# Altium schematic sheet Motor_Driver.SchDoc
size A4; SheetNumber: 3; SheetTotal: 6
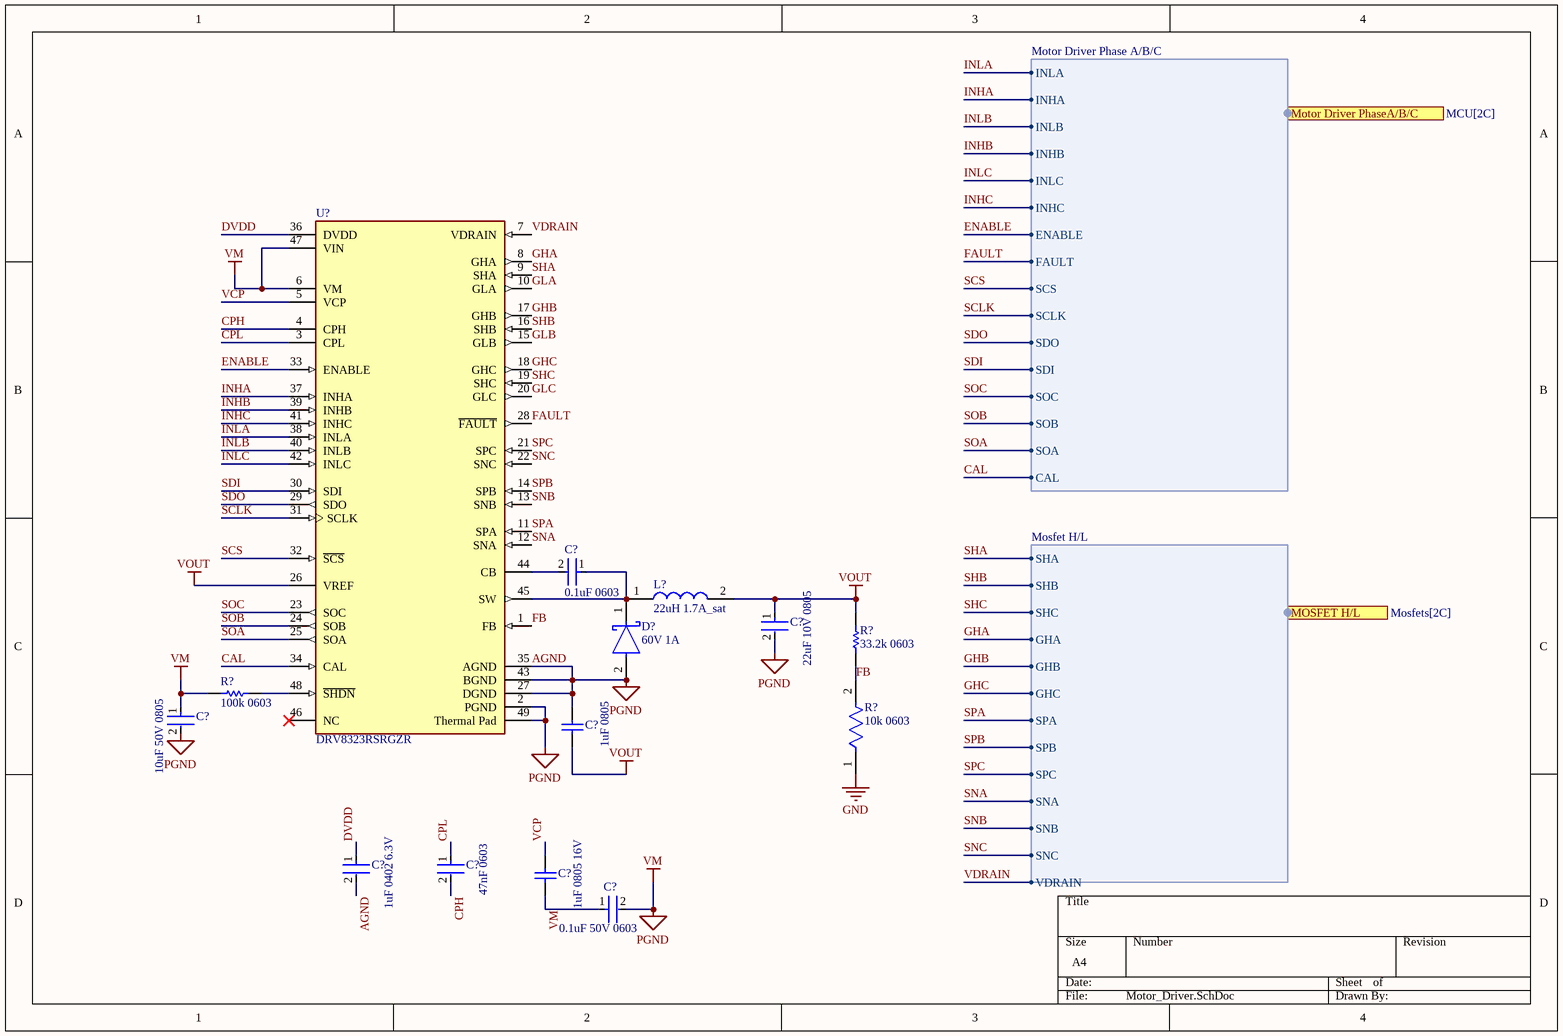
[diagram p0: Motor_Driver.SchDoc]

## Parts
(Parts that share a designator on the sheet are numbered #1, #2 ... from top to bottom, then left to right.)
C?#1  0.1uF 0603  [FP-0603B104K500CT-IPC_C]
C?#2  22uF 10V 0805  [FP-GRM21B-0_2-e0_2_0_7-MFG]
C?#3  10uF 50V 0805  [FP-GRM21B-0_2-e0_2_0_7-IPC_A]
C?#4  1uF 0805  [CAPC2013X140X50NL20T25]
C?#5  1uF 0402 6.3V  [FP-GRT155-0_05-IPC_C]
C?#6  47nF 0603  [FP-C0603C-CF-MFG]
C?#7  1uF 0805 16V  [CAPC2013X140X50NL20T25]
C?#8  0.1uF 50V 0603  [FP-0603B104K500CT-IPC_C]
D?  60V 1A  [FP-SMA-MFG]
L?  22uH 1.7A_sat  [INDPM6054X300N]
R?#1  33.2k 0603  [RESC1608X55X25NL10T15]
R?#2  100k 0603  [RESC1608X55X25ML10T15]
R?#3  10k 0603  [FP-RT0603-MFG]
U?  DRV8323RSRGZR  [FP-RGZ0048A-MFG]

## Ports
MOSFET H/L (harness Mosfet H/L, see Mosfets[2C]), Motor Driver PhaseA/B/C (harness Motor Driver Phase A/B/C, see MCU[2C])

## Harnesses
Motor Driver Phase A/B/C: INLA, INLC, INHB, INLB, INHA, INHC, ENABLE, FAULT, SCLK, SDO, SDI, SCS, SOC, SOB, SOA, CAL
Mosfet H/L: SHA, SHB, SHC, GHA, GHB, GHC, SPB, SPA, SPC, SNA, SNB, SNC, VDRAIN

## Nets
AGND: C?#2.2 C?#3.1 C?#3.2 C?#4.2 C?#5.2 C?#7.1 C?#8.1 C?#8.2 D?.2(A) R?#2.2 U?.2(PGND) U?.6(VM) U?.27(DGND) U?.35(AGND) U?.43(BGND) U?.47(VIN) U?.49(Thermal_Pad)  [also labelled PGND, VM]
GND: R?#3.1
VOUT: C?#2.1 C?#4.1 L?.2 R?#1.2 U?.26(VREF)
CAL: U?.34(CAL) ; port Motor Driver PhaseA/B/C.CAL
CPH: C?#6.2 U?.4(CPH)
CPL: C?#6.1 U?.3(CPL)
DVDD: C?#5.1 U?.36(DVDD)
ENABLE: U?.33(ENABLE) ; port Motor Driver PhaseA/B/C.ENABLE
FAULT: U?.28(~{FAULT}) ; port Motor Driver PhaseA/B/C.FAULT
FB: R?#1.1 R?#3.2 U?.1(FB)
GHA: U?.8(GHA) ; port MOSFET H/L.GHA
GHB: U?.17(GHB) ; port MOSFET H/L.GHB
GHC: U?.18(GHC) ; port MOSFET H/L.GHC
GLA: U?.10(GLA)
GLB: U?.15(GLB)
GLC: U?.20(GLC)
INHA: U?.37(INHA) ; port Motor Driver PhaseA/B/C.INHA
INHB: U?.39(INHB) ; port Motor Driver PhaseA/B/C.INHB
INHC: U?.41(INHC) ; port Motor Driver PhaseA/B/C.INHC
INLA: U?.38(INLA) ; port Motor Driver PhaseA/B/C.INLA
INLB: U?.40(INLB) ; port Motor Driver PhaseA/B/C.INLB
INLC: U?.42(INLC) ; port Motor Driver PhaseA/B/C.INLC
SCLK: U?.31(SCLK) ; port Motor Driver PhaseA/B/C.SCLK
SCS: U?.32(~{SCS}) ; port Motor Driver PhaseA/B/C.SCS
SDI: U?.30(SDI) ; port Motor Driver PhaseA/B/C.SDI
SDO: U?.29(SDO) ; port Motor Driver PhaseA/B/C.SDO
SHA: U?.9(SHA) ; port MOSFET H/L.SHA
SHB: U?.16(SHB) ; port MOSFET H/L.SHB
SHC: U?.19(SHC) ; port MOSFET H/L.SHC
SNA: U?.12(SNA) ; port MOSFET H/L.SNA
SNB: U?.13(SNB) ; port MOSFET H/L.SNB
SNC: U?.22(SNC) ; port MOSFET H/L.SNC
SOA: U?.25(SOA) ; port Motor Driver PhaseA/B/C.SOA
SOB: U?.24(SOB) ; port Motor Driver PhaseA/B/C.SOB
SOC: U?.23(SOC) ; port Motor Driver PhaseA/B/C.SOC
SPA: U?.11(SPA) ; port MOSFET H/L.SPA
SPB: U?.14(SPB) ; port MOSFET H/L.SPB
SPC: U?.21(SPC) ; port MOSFET H/L.SPC
VCP: C?#7.2 U?.5(VCP)
VDRAIN: U?.7(VDRAIN) ; port MOSFET H/L.VDRAIN
NetC?#1_1: C?#1.1 D?.1(C) L?.1 U?.45(SW)
NetC?#1_2: C?#1.2 U?.44(CB)
NetR?#2_1: R?#2.1 U?.48(~{SHDN})

Not connected (* = marked no-connect by the designer): U? 46(NC)*

## Library data of the parts
C?#1 C?#8 = CMP-45632-000007-1: CAP CER 0.1UF 50V X7R 0603; Tolerance: 10%; Capacitance: 100nF; Radiation Hardening: No; Depth: 0.8mm; Length: 1.6mm; Voltage Rating: 50V; Dielectric: X7R; Case/Package: 0603; RoHS Compliant: Yes; Case Code (Metric): 1608; Voltage Rating (DC): 50V; Min Operating Temperature: -55°C; Series: -; Max Operating Temperature: 125°C; Lead Free: Lead Free; Case Code (Imperial): 0603; Packaging: Tape and Reel
C?#2 = CMP-06035-051066-1: Chip Multilayer Ceramic Capacitors for General Purpose, 0805, 22uF, X7R, 15%, 20%, 10V
C?#3 = CMP-06035-004402-1: Chip Multilayer Ceramic Capacitors for General Purpose, 0805, 10uF, X5R, 15%, 10%, 50V; Voltage Rating (DC): 50V; Dielectric: X5R; Tolerance: 10%; Capacitance: 10uF; Thickness: 1.25mm; Length: 2mm; Width: 1.25mm
C?#4 C?#7 = CMP-2007-03229-1: Part Number: C0805C105J4RACTU; Manufacturer: Kemet
C?#5 = CMP-06035-034802-1: Multi-Layer Ceramic Capacitor 1uF 6.3V X7R ±10% 0402 Paper T/R
C?#6 = CMP-2006-03882-2: CAP CER 0.047UF 25V 10% X7R 0603; Manufacturer: KEMET; Manufacturer Part Number: C0603C473K3RACTU; Capacitance: 47,000 pF; Temperature Coefficient: 30ppm/°C; Material: Ceramic; Tolerance: 0.1; Value: 47,000 pF; Automotive Grade: Grade 1; Height: 0.87mm; Voltage Rating: 25 V; Automotive: Yes; Device Class L3: Ceramic Capacitors; Device Class L2: Capacitors; Mouser Description: Multilayer Ceramic Capacitor, C Series, 0.047 - F, - 10%, X7R, 25 V, 0603 [1608 Metric] Rohs Compliant: Yes; Digikey Description: CAP CER 0.047UF 25V 10% X7R 0603; Temperature Characteristic: X7R; Package: C0603C-CF; Device Class L1: Passive Components; Temperature: -55°C to +125°C; Octopart: https://octopart.com/c0603c473k3ractu-kemet-3834514; RoHS: TRUE; ComponentLink2Description: Datasheet; Temperature Range Low: -55°C; Temperature Range High: +125°C; Category: Cap; ComponentLink2URL: https://api.kemet.com/component-edge/download/datasheet/C0603C100J5GACAUTO.pdf; Lead Free: Yes
D? = CMP-2000-05885-2: DIODE SCHOTTKY 60V 1A SMA; Polarity: Standard; Element Configuration: Single; Peak Reverse Current: 500uA; Capacitance: 110pF; Peak Non-Repetitive Surge Current: 30A; Forward Voltage: 700mV; Termination: SMD/SMT; Radiation Hardening: No; Number of Pins: 2; Packaging: Tape and Reel; Length: 4.6mm; Current Rating: 1A; Lead Free: Lead Free; Output Current: 1A; Max Operating Temperature: 150°C; Min Operating Temperature: -65°C; Forward Current: 1A; Mount: Surface Mount; Width: 2.92mm; Average Rectified Current: 1A; Max Forward Surge Current (Ifsm): 30A; Voltage Rating (DC): 60V; Height: 2.1mm; REACH SVHC: No SVHC; Max Reverse Voltage (DC): 60V; Max Repetitive Reverse Voltage (Vrrm): 60V; Weight: 0.002258oz; Contact Plating: Tin; Case/Package: SMA; Package Quantity: 5000
L? = PA4340.223NLT: Inductor; Manufacturer_Name: Yageo Group; Datasheet Link: https://www.arrow.com/en/products/pa4340.223nlt/pulse-electronics-corporation?region=nac; Height: 3mm; Manufacturer_Part_Number: PA4340.223NLT; Mouser Part Number: 673-PA4340.223NLT; Mouser Price/Stock: https://www.mouser.co.uk/ProductDetail/Pulse-Electronics/PA4340.223NLT?qs=%2FzQKu7YvIMbPZYBkc4u0sg%3D%3D; Arrow Part Number: PA4340.223NLT; Arrow Price/Stock: https://www.arrow.com/en/products/pa4340.223nlt/pulse-electronics-corporation?utm_currency=USD&region=europe
R?#1 = CMP-1659-00059-1: Chip Resistor, 33.2 KOhm, +/- 1%, 100 mW, -55 to 155 degC, 0603 (1608 Metric), RoHS, Tape and Reel; Tolerance: 20ppm; Capacitance: 1.8E-11 f; Resistance: 70 Ohm; Frequency: 12 MHz; Load Capacitance: 18 pF; Length: 0.197 inch; Min Operating Temperature: -20degC; PackageReference: 0603; ComponentLink2URL: http://www.yageo.com/documents/recent/PYu-RC_Group_51_RoHS_L_04.pdf; Radiation Hardening: No; Package Quantity: 1000; Height: 0.043 inch; Packaging: Tape and Reel; ComponentLink1URL: http://www.yageo.com/; PackageDescription: 2-Pin Surface Mount Device, Body 1.6 x 0.8 mm; Max Operating Temperature: 70degC; ComponentLink1Description: Manufacturer URL; DatasheetVersion: Rev. 4, 02/2016; Width: 0.126 inch; ComponentLink2Description: Datasheet; Frequency Tolerance: 20ppm; Case/Package: CSMD; Pins: 4; RoHSCompliant: True; ESR: 70 Ohm; REACH SVHC: No SVHC; Mount: Surface Mount
R?#2 = CMP-2000-04193-1: Manufacturer: Yageo; Part Number: RC0603FR-13100KL
R?#3 = CMP-03412-009989-1: RES SMD 10K OHM 0.1% 1/10W 0603; Manufacturer: Yageo; Manufacturer Part Number: RT0603BRC0710KL; Tolerance: 0.001; Value: 10KΩ; Power Rating: 0.1W; Voltage Rating: 75V; Temperature Coefficient: 15 ppm/°C; Device Class L2: Resistors; Temperature: -55°C to +155°C; Device Class L3: Chip SMD Resistors; Series: RT; RoHS: TRUE; Category: Res; Composition: Thin Film; Temperature Range Low: -55°C; Resistance: 10KΩ; Temperature Range High: +155°C; Package: RT0603; Height: 0.55mm; Automotive: No; Device Class L1: Passive Components; Lead Free: Yes; Digikey Description: RES SMD 10K OHM 0.1% 1/10W 0603; Ipc Land Pattern Name: RESC16080X45; Octopart: https://octopart.com/rt0603brc0710kl-yageo-20648660; Footprint Url: http://www.yageo.com/exep/pages/download/literatures/PYu-R_Mount_10.pdf; ComponentLink2Description: Datasheet; ComponentLink2URL: http://www.yageo.com/documents/recent/PYu-RT_1-to-0.01_RoHS_L_9.pdf; Mouser Description: Res Thin Film 0603 10K Ohm 0.1% 1/10W ±15ppm/°C Molded SMD Paper T/R
U? = CMP-04915-000002-1: IC MTR DRV MULTIPHAS 6-60V 48QFN; Manufacturer: Texas Instruments; Min Supply Voltage: 4V; Description: Multiphase Motor Driver Power MOSFET SPI 48-VQFN (7x7); Switching Frequency: 700kHz; Nominal Supply Current: 10.5mA; Max Supply Voltage: 60V; Standoff Height: 0mm; Motor Type: Brushless DC; Output Current: 5mA; Max Junction Temp: +150°C; Category: IC; Digikey Description: IC MTR DRV MULTIPHAS 6-60V 48QFN; Height: 1mm; Lead Free: Yes; Device Class L1: Integrated Circuits (ICs); ComponentLink2Description: Datasheet; Manufacturer Part Number: DRV8323RSRGZR; RoHS: TRUE; ComponentLink2URL: http://www.ti.com/lit/ds/symlink/drv8323r.pdf; Ambient Temperature Range Low: -40°C; Octopart: https://octopart.com/drv8323rsrgzr-texas+instruments-80665177; Ambient Temperature Range High: +125°C; Temperature Range Low: -40°C; Temperature Range High: +125°C; Device Class L3: Motor Drivers; Package: RGZ0048A; Automotive: No; Device Class L2: Power Management ICs; Temperature: -40°C to +125°C; Mouser Description: Triple Half Bridge Motor Driver 48-Pin VQFN EP T/R